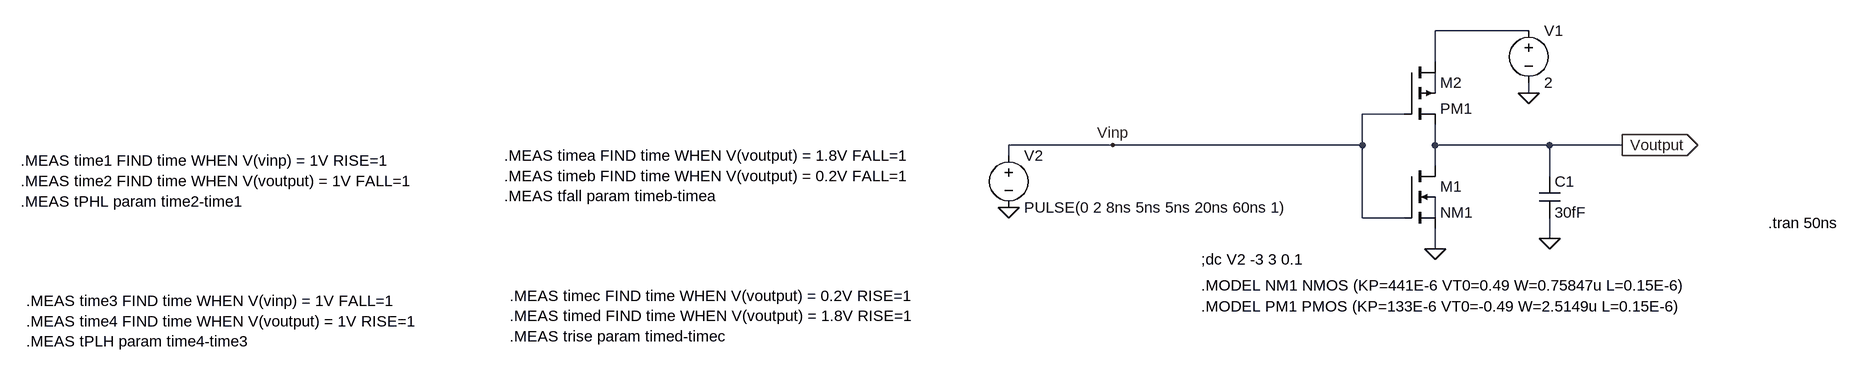
[diagram p0: schematic inversor.asc]
inversor.asc, the LTspice schematic file:
Version 4
SHEET 1 888 680
WIRE 384 16 240 16
WIRE 240 64 240 16
WIRE 240 112 240 80
WIRE 384 112 384 96
WIRE 192 144 128 144
WIRE -256 192 -416 192
WIRE 128 192 128 144
WIRE 128 192 -256 192
WIRE 240 192 240 160
WIRE 416 192 240 192
WIRE 528 192 416 192
WIRE -416 208 -416 192
WIRE 240 224 240 192
WIRE 416 240 416 192
WIRE 128 304 128 192
WIRE 192 304 128 304
WIRE 240 304 240 272
WIRE 416 336 416 304
WIRE 240 352 240 320
FLAG 384 112 0
FLAG 528 192 Voutput
IOPIN 528 192 Out
FLAG -416 288 0
FLAG 240 352 0
FLAG 416 336 0
FLAG -256 192 Vinp
SYMBOL pmos4 192 64 R0
SYMATTR InstName M2
SYMATTR Value PM1
SYMBOL voltage 384 0 R0
WINDOW 123 0 0 Left 0
WINDOW 39 0 0 Left 0
SYMATTR InstName V1
SYMATTR Value 2
SYMBOL voltage -416 192 R0
WINDOW 123 0 0 Left 0
WINDOW 39 0 0 Left 0
SYMATTR InstName V2
SYMATTR Value PULSE(0 2 8ns 5ns 5ns 20ns 60ns 1)
SYMBOL nmos4 192 224 R0
SYMATTR InstName M1
SYMATTR Value NM1
SYMBOL cap 400 240 R0
SYMATTR InstName C1
SYMATTR Value 30fF
TEXT -120 408 Left 2 !.MODEL NM1 NMOS (KP=441E-6 VT0=0.49 W=0.75847u L=0.15E-6)
TEXT -120 440 Left 2 !.MODEL PM1 PMOS (KP=133E-6 VT0=-0.49 W=2.5149u L=0.15E-6)
TEXT -120 368 Left 2 !;dc V2 -3 3 0.1
TEXT 752 312 Left 2 !.tran 50ns
TEXT -1936 216 Left 2 !.MEAS time1 FIND time WHEN V(vinp) = 1V RISE=1\n.MEAS time2 FIND time WHEN V(voutput) = 1V FALL=1\n.MEAS tPHL param time2-time1
TEXT -1928 432 Left 2 !.MEAS time3 FIND time WHEN V(vinp) = 1V FALL=1\n.MEAS time4 FIND time WHEN V(voutput) = 1V RISE=1\n.MEAS tPLH param time4-time3
TEXT -1192 208 Left 2 !.MEAS timea FIND time WHEN V(voutput) = 1.8V FALL=1\n.MEAS timeb FIND time WHEN V(voutput) = 0.2V FALL=1\n.MEAS tfall param timeb-timea
TEXT -1184 424 Left 2 !.MEAS timec FIND time WHEN V(voutput) = 0.2V RISE=1\n.MEAS timed FIND time WHEN V(voutput) = 1.8V RISE=1\n.MEAS trise param timed-timec

The netlist it stands for:
* inversor.asc
M2 N001 Vinp Voutput N002 PM1
V1 N001 0 2
V2 Vinp 0 PULSE(0 2 8ns 5ns 5ns 20ns 60ns 1)
M1 Voutput Vinp 0 N003 NM1
C1 Voutput 0 30fF
.model NMOS NMOS
.model PMOS PMOS
.lib standard.mos
.MODEL NM1 NMOS (KP=441E-6 VT0=0.49 W=0.75847u L=0.15E-6)
.MODEL PM1 PMOS (KP=133E-6 VT0=-0.49 W=2.5149u L=0.15E-6)
;dc V2 -3 3 0.1
.tran 50ns
.MEAS time1 FIND time WHEN V(vinp) = 1V RISE=1
.MEAS time2 FIND time WHEN V(voutput) = 1V FALL=1
.MEAS tPHL param time2-time1
.MEAS time3 FIND time WHEN V(vinp) = 1V FALL=1
.MEAS time4 FIND time WHEN V(voutput) = 1V RISE=1
.MEAS tPLH param time4-time3
.MEAS timea FIND time WHEN V(voutput) = 1.8V FALL=1
.MEAS timeb FIND time WHEN V(voutput) = 0.2V FALL=1
.MEAS tfall param timeb-timea
.MEAS timec FIND time WHEN V(voutput) = 0.2V RISE=1
.MEAS timed FIND time WHEN V(voutput) = 1.8V RISE=1
.MEAS trise param timed-timec
.backanno
.end